# Altium project rf_test_source.PrjPcb (part 2 of 2)
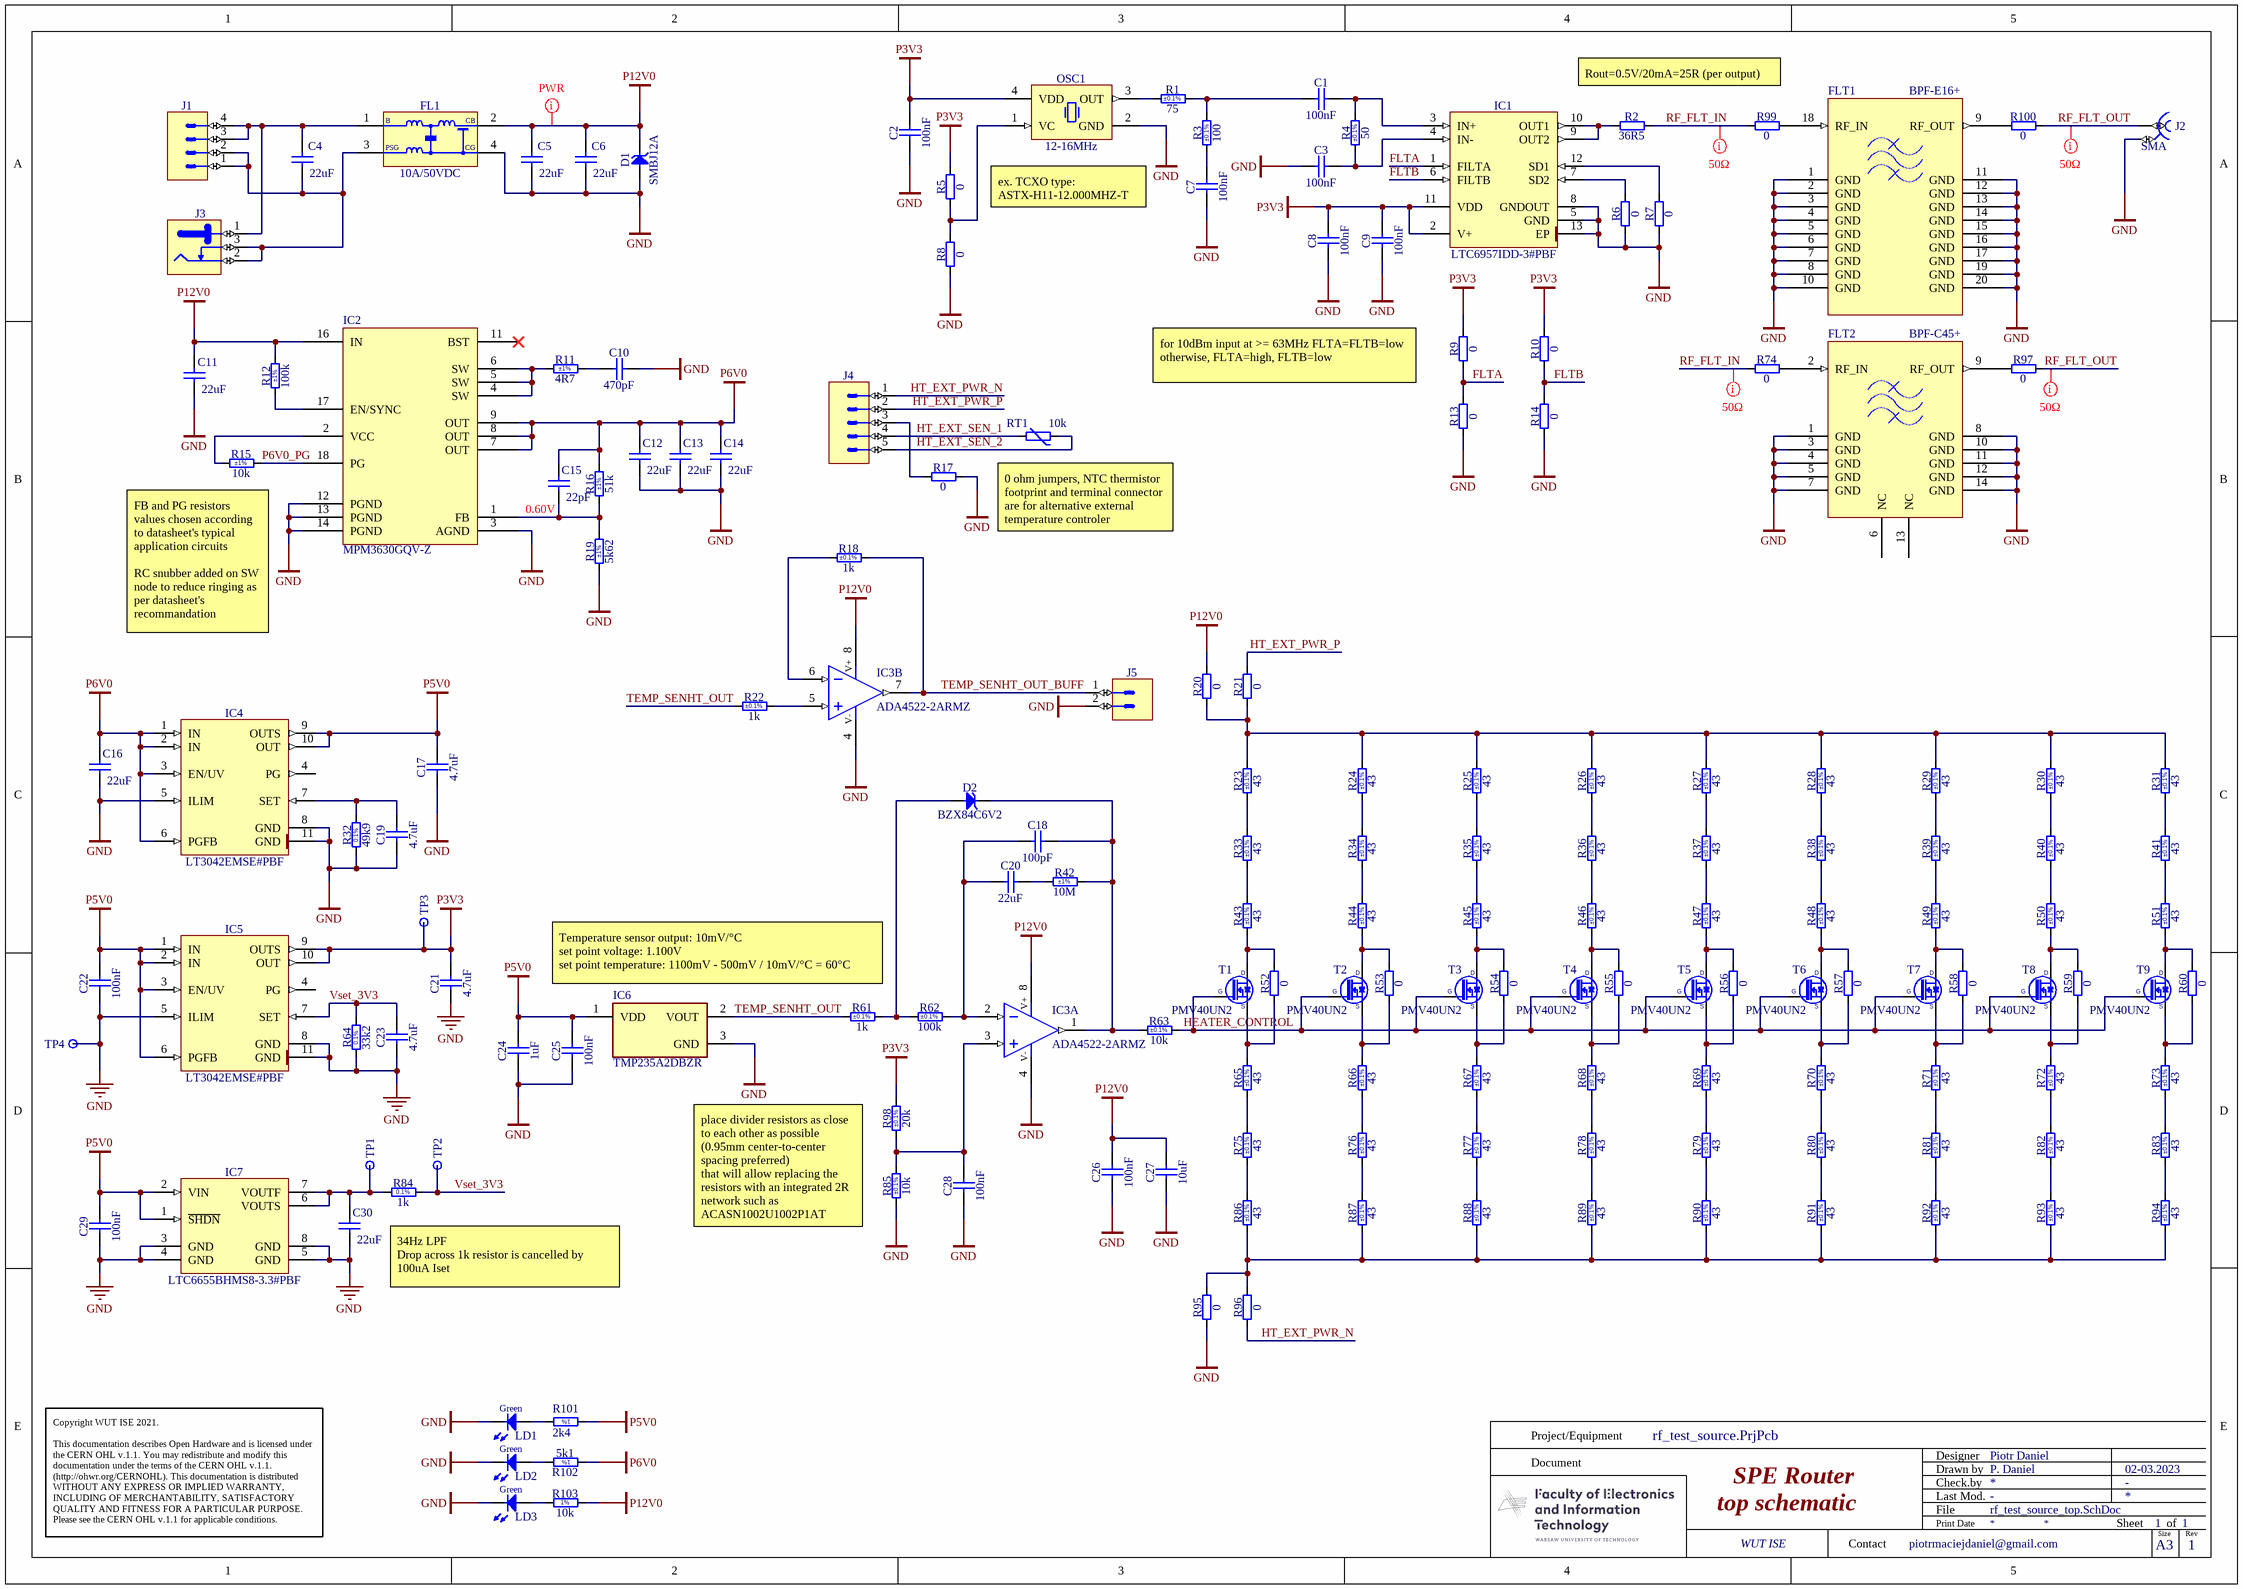
[diagram p1: rf_test_source_top.SchDoc]

## Sheet rf_test_source_top.SchDoc: SPE Router (continued)

### Library data of the parts
C1-C3 C7-C9 C22 C29 = CC0603_100NF_50V_10%_X7R: Non-polarised capacitor; Part Description: SMD Multilayer Chip Ceramic Capacitor; Manufacturer: GENERIC; Manufacturer1 Part Number: 223858615649; Voltage: 50V; TC: X7R; Tolerance: ±10%; Part Number: CC0603_100NF_50V_10%_X7R; Component Kind: Standard; Component Type: Standard; Pin Count: 2; Value: 100nF; Status: Preferred; Manufacturer Part Number: CC0603_100NF_50V_10%_X7R; Case: 0603; Mounted: Yes; Socket: No; SMD: Yes; Sense: No; Manufacturer1 Example: PHYCOMP; Manufacturer1 ComponentHeight: 0.87mm; HelpURL: \\cern.ch\dfs\Applications\Altium\Datasheets\CC0603_X7R_PHYCOMP.pdf; Author: CERN DEM JLC; CreateDate: 03/12/2007; LatestRevisionDate: 03/12/2007
C4-C6 C11-C14 C16 C30 = CC1210_22UF_25V_10%_X7R: Non-polarised capacitor; Part Description: SMD Multilayer Chip Ceramic Capacitor; Manufacturer: GENERIC; Manufacturer1 Part Number: C1210C226K3RAC; Voltage: 25V; TC: X7R; Tolerance: ±10%; Part Number: CC1210_22UF_25V_10%_X7R; Component Kind: Standard; Component Type: Standard; Pin Count: 2; Value: 22uF; Status: None; Manufacturer Part Number: CC1210_22UF_25V_10%_X7R; Case: 1210; Mounted: Yes; Socket: No; SMD: Yes; Sense: No; Manufacturer1 Example: KEMET; Manufacturer1 ComponentHeight: 1.4mm; HelpURL: \\cern.ch\dfs\Applications\Altium\Datasheets\CC1210_X7R_KEMET.pdf; Author: CERN DEM BC; CreateDate: 20.08.2020; LatestRevisionDate: 20.08.2020
C10 = CC0402_470PF_50V_10%_X7R: Non-polarised capacitor; Part Description: SMD Multilayer Chip Ceramic Capacitor; Manufacturer: GENERIC; Manufacturer1 Part Number: 223858715618; Voltage: 50V; TC: X7R; Tolerance: ±10%; Part Number: CC0402_470PF_50V_10%_X7R; Component Kind: Standard; Component Type: Standard; Pin Count: 2; Value: 470pF; Status: Not Recommended; Manufacturer Part Number: CC0402_470PF_50V_10%_X7R; Case: 0402; Mounted: Yes; Socket: No; SMD: Yes; Sense: No; Manufacturer1 Example: PHYCOMP; Manufacturer1 ComponentHeight: 0.55mm; HelpURL: \\cern.ch\dfs\Applications\Altium\Datasheets\CC0402_NP0_PHYCOMP.pdf; Author: CERN DEM JLC; CreateDate: 03.12.2007; LatestRevisionDate: 03.12.2007
C15 = CC0402_22PF_50V_5%_C0G: Non-polarised capacitor; Part Description: SMD Multilayer Chip Ceramic Capacitor; Manufacturer: GENERIC; Manufacturer1 Part Number: C0402C220J5GACTU; Voltage: 50V; TC: C0G/NP0; Tolerance: ±5%; Part Number: CC0402_22PF_50V_5%_C0G; Component Kind: Standard; Component Type: Standard; Pin Count: 2; Value: 22pF; Status: Preferred; Manufacturer Part Number: CC0402_22PF_50V_5%_C0G; Case: 0402; Mounted: Yes; Socket: No; SMD: Yes; Sense: No; Manufacturer1 Example: KEMET; Manufacturer1 ComponentHeight: 0.55mm; HelpURL: \\cern.ch\dfs\Applications\Altium\Datasheets\CC0402_C0G_KEMET_(Commercial Grade).pdf; Author: CERN DEM JLC; CreateDate: 03.12.2007; LatestRevisionDate: 03.12.2007
C17 C19 C21 C23 = CC1206_4.7UF_16V_10%_X5R: Non-polarised capacitor; Part Description: SMD Multilayer Chip Ceramic Capacitor; Manufacturer: GENERIC; Manufacturer1 Part Number: C1206C475K4PAC; Voltage: 16V; TC: X5R; Tolerance: ±10%; Part Number: CC1206_4.7UF_16V_10%_X5R; Component Kind: Standard; Component Type: Standard; Pin Count: 2; Value: 4.7uF; Status: Preferred; Manufacturer Part Number: CC1206_4.7UF_16V_10%_X5R; Case: 1206; Mounted: Yes; Socket: No; SMD: Yes; Sense: No; Manufacturer1 Example: KEMET; Manufacturer1 ComponentHeight: 1.8mm; HelpURL: \\cern.ch\dfs\Applications\Altium\Datasheets\CC1206_X5R_KEMET.pdf; Author: CERN DEM JLC; CreateDate: 03/12/2007; LatestRevisionDate: 03/12/2007
C18 = CC0603_100PF_50V_5%_NP0: Non-polarised capacitor; Part Description: SMD Multilayer Chip Ceramic Capacitor; Manufacturer: GENERIC; Manufacturer1 Part Number: 223886715101; Voltage: 50V; TC: C0G/NP0; Tolerance: ±5%; Part Number: CC0603_100PF_50V_5%_NP0; Component Kind: Standard; Component Type: Standard; Pin Count: 2; Value: 100pF; Status: Preferred; Manufacturer Part Number: CC0603_100PF_50V_5%_NP0; Case: 0603; Mounted: Yes; Socket: No; SMD: Yes; Sense: No; Manufacturer1 Example: PHYCOMP; Manufacturer1 ComponentHeight: 0.87mm; HelpURL: \\cern.ch\dfs\Applications\Altium\Datasheets\CC0603_NP0_PHYCOMP.pdf; Author: CERN DEM JLC; CreateDate: 03.12.2007; LatestRevisionDate: 03.12.2007
C20 = CC0805_22UF_16V_10%_X5R: Non-polarised capacitor; Part Description: SMD Multilayer Chip Ceramic Capacitor; Manufacturer: GENERIC; Manufacturer1 Part Number: C2012X5R1C226KT; Voltage: 16V; TC: X5R; Tolerance: ±10%; Part Number: CC0805_22UF_16V_10%_X5R; Component Kind: Standard; Component Type: Standard; Pin Count: 2; Value: 22uF; Status: Preferred; Manufacturer Part Number: CC0805_22UF_16V_10%_X5R; Case: 0805; Mounted: Yes; Socket: No; SMD: Yes; Sense: No; Manufacturer1 Example: TDK; Manufacturer1 ComponentHeight: 1.35mm; HelpURL: \\cern.ch\dfs\Applications\Altium\Datasheets\CC0805_X5R_TDK_C.pdf; Author: CERN DEM JLC; CreateDate: 25.10.2012; LatestRevisionDate: 25.10.2012
C24 = CC0603_1UF_25V_10%_X7R: Non-polarised capacitor; Part Description: SMD Multilayer Chip Ceramic Capacitor; Manufacturer: GENERIC; Manufacturer1 Part Number: GRM188R71E105KA12D; Voltage: 25V; TC: X7R; Tolerance: ±10%; Part Number: CC0603_1UF_25V_10%_X7R; Component Kind: Standard; Component Type: Standard; Pin Count: 2; Value: 1uF; Status: None; Manufacturer Part Number: CC0603_1UF_25V_10%_X7R; Case: 0603; Mounted: Yes; Socket: No; SMD: Yes; Sense: No; Manufacturer1 Example: MURATA; Manufacturer1 ComponentHeight: 0.9mm; HelpURL: \\cern.ch\dfs\Applications\Altium\Datasheets\CC0603_X7R_MURATA.pdf; Author: CERN DEM JLC; CreateDate: 18.01.2011; LatestRevisionDate: 18.01.2011
C25 C26 C28 = CC0402_100NF_16V_10%_X7R: Non-polarised capacitor; Part Description: SMD Multilayer Chip Ceramic Capacitor; Manufacturer: GENERIC; Manufacturer1 Part Number: GRM155R71C104KA88D; Voltage: 16V; TC: X7R; Tolerance: ±10%; Part Number: CC0402_100NF_16V_10%_X7R; Component Kind: Standard; Component Type: Standard; Pin Count: 2; Value: 100nF; Status: Not Recommended; Manufacturer Part Number: CC0402_100NF_16V_10%_X7R; Case: 0402; Mounted: Yes; Socket: No; SMD: Yes; Sense: No; Manufacturer1 Example: MURATA; Manufacturer1 ComponentHeight: 0.55mm; HelpURL: \\cern.ch\dfs\Applications\Altium\Datasheets\CC0402_X7R_MURATA_GRM.pdf; Author: CERN DEM JLC; CreateDate: 05.12.2013; LatestRevisionDate: 03.12.2007
C27 = CC0805_10UF_10V_10%_X7R: Non-polarised capacitor; Part Description: SMD Multilayer Chip Ceramic Capacitor; Manufacturer: GENERIC; Manufacturer1 Part Number: GRM21BR71A106KE51L; Voltage: 10V; TC: X7R; Tolerance: ±10%; Part Number: CC0805_10UF_10V_10%_X7R; Component Kind: Standard; Component Type: Standard; Pin Count: 2; Value: 10uF; Status: Preferred; Manufacturer Part Number: CC0805_10UF_10V_10%_X7R; Case: 0805; Mounted: Yes; Socket: No; SMD: Yes; Sense: No; Manufacturer1 Example: MURATA; Manufacturer1 ComponentHeight: 1.35mm; HelpURL: \\cern.ch\dfs\Applications\Altium\Datasheets\CC0805_X7R_MURATA.pdf; Author: CERN DEM JLC; CreateDate: 30.04.2012; LatestRevisionDate: 30.04.2012
D1 = SMBJ12A: Zener Diode; Part Description: Uni-Directional Transient Voltage Suppressor Diode; Manufacturer: FAIRCHILD SEMICONDUCTOR; Voltage: 12V; Power: 600W; PressFit: No; Bonding: No; Part Number: SMBJ12A; Component Kind: Standard; Component Type: Standard; Device: SMBJ12A; PackageDescription: DO-214-AA/SMB Diode, Molded Body; 5.34mm L X 3.625mm W X 2.65mm H, IPC Medium Density; Manufacturer Part Number: SMBJ12A; Pin Count: 2; Case: DO-214AA; Mounted: Yes; Socket: No; SMD: Yes; Sense: No; ComponentHeight: 2.65mm; HelpURL: \\cern.ch\dfs\Applications\Altium\Datasheets\SMBJ.pdf; Author: CERN DEM JLC; CreateDate: 10.04.2013; LatestRevisionDate: 10.04.2013
D2 = BZX84C6V2: Diode Zener Anode Pin 1 Cathode Pin 3 (Pas de pin 2); Part Description: Small Signal Zener Diode; Manufacturer: VISHAY SEMICONDUCTORS; Voltage: 6V2; Power: 300mW; PressFit: No; Bonding: No; Part Number: BZX84C6V2; Component Kind: Standard; Component Type: Standard; Device: BZX84C6V2; PackageDescription: SOT, 0.95mm Pitch; 3 Pin, 1.315mm W X 2.95mm L X 1.15mm H body, IPC Medium Density; Manufacturer Part Number: BZX84C6V2; Pin Count: 3; Case: SOT23-3; Mounted: Yes; Socket: No; SMD: Yes; Sense: No; ComponentHeight: 1.15mm; HelpURL: \\cern.ch\dfs\Applications\Altium\Datasheets\BZX84C6V2.pdf; Author: CERN DEM BC; CreateDate: 10.10.2019; LatestRevisionDate: 10.10.2019
FL1 = FIL_MURATA_BNX022-01L: Block Type EMIFIL (LC Combined); Part Description: Block Type EMIFIL (LC Combined) SMD Type, BNX02* Series; Manufacturer: MURATA; Resistance: 0.5R; Part Number: FIL_MURATA_BNX022-01L; Component Kind: Standard; Component Type: Standard; Pin Count: 2; Value: 10A/50VDC; Status: None; Manufacturer Part Number: BNX022-01L; Mounted: Yes; Socket: No; SMD: Yes; Sense: No; ComponentHeight: 3.3mm; HelpURL: \\cern.ch\dfs\Applications\Altium\Datasheets\FIL_MURATA_BNX022-01L.pdf; Author: CERN DEM JLC; CreateDate: 10.10.2012; LatestRevisionDate: 10.10.2012
FLT1 = BPF-E16+: Band Pass Filter, 16MHz; Manufacturer: Mini-Circuits; Average Input Power: 500mW; Input Impedance: 50R; Insertion Loss-Max: 3dB; VSWR: 1.9; Supplier 1: Digikey; Manufacturer Part Number: BPF-E16+; RoHS: Yes; Stock 1: 41; Pricing 1: 1=36,35, 10=33,312, 50=31,8 (USD); Mounting Technology: Surface Mount; Terminal Finish: Gold; Min Operating Temperature: -40°C; Max Operating Temperature: 85°C; JESD-609 Code: e4; Center or Cutoff Frequency (fo/fc): 16MHz; Filter Type: BAND PASS FILTER; Output Impedance: 50R; Length: 30.48mm; Width: 30.48mm; Height: 9.4mm; RoHS Compliant: Yes; Reach SVHC Compliant: Yes; ComponentLink1URL: https://datasheet.ciiva.com:443/pdfs/VipMasterIC/IC/MINI/MINI-S-A0002947472/MINI-S-A0002947472-1.pdf?src-supplier=IHS+Markit; ComponentLink1Description: https://datasheet.ciiva.com:443/pdfs/VipMasterIC/IC/MINI/MINI-S-A0002947472/MINI-S-A0002947472-1.pdf?src-supplier=IHS+Markit; Supplier Part Number 1: 3157-BPF-E16+CT-ND
FLT2 = BPF-C45+: Band Pass Filter, 45MHz, 14 Pin(s); Manufacturer: Mini-Circuits; Supplier 1: Digikey; Manufacturer Part Number: BPF-C45+; RoHS: Yes; Stock 1: 219; Pricing 1: 1=48,49, 10=45,456, 25=42,4204, 50=40,908, 100=39,3841 (USD); Supplier Part Number 1: 3157-BPF-C45+CT-ND
IC1 = LTC6957IDD-3#PBF: Low Phase Noise, Dual Output Buffer/Driver/Logic Converter, CMOS Logic, In-Phase Outputs; Manufacturer: LINEAR TECHNOLOGY; PressFit: No; Bonding: No; Part Number: LTC6957IDD-3#PBF; Component Kind: Standard; Component Type: Standard; Device: LTC6957IDD-3#PBF; PackageDescription: SON, 0.45mm Pitch; 12 Pin, 3.00mm W X 3.00mm L X 0.80mm H Body (w/Thermal tab 1.75 x 2.48mm), IPC Medium Density; Part Description: Low Phase Noise, Dual Output Buffer/Driver/Logic Converter, CMOS Logic, In-Phase Outputs; Manufacturer Part Number: LTC6957IDD-3#PBF; Pin Count: 13; Case: SON12; Mounted: Yes; Socket: No; SMD: Yes; Sense: No; ComponentHeight: 0.8mm; Author: CERN DEM JMW; HelpURL: \\cern.ch\dfs\Applications\Altium\Datasheets\LTC6957IDD-3#PBF.pdf; CreateDate: 08/08/2016; LatestRevisionDate: 07/12/2016
IC2 = MPM3630GQV-Z: 18V/3A DC/DC Module Synchronous Step-Down Regulator with Integrated Inductor; Manufacturer: Monolithic Power Systems; Supplier 1: Farnell; Manufacturer Part Number: MPM3630GQV-Z; RoHS: Yes; Category: Board Mount Modules; Stock 1: 4233; Case/Package: QFN; Pins: 18; Series: *; RoHS Compliant: Yes; ComponentLink1URL: http://www.monolithicpower.com/pub/media/document/MPM3630_r1.0.pdf?src-supplier=Digikey; ComponentLink1Description: http://www.monolithicpower.com/pub/media/document/MPM3630_r1.0.pdf?src-supplier=Digikey; ComponentLink2URL: https://www.monolithicpower.com/pub/media/document/MPM3630_r1.0.pdf?src-supplier=Digikey; ComponentLink2Description: https://www.monolithicpower.com/pub/media/document/MPM3630_r1.0.pdf?src-supplier=Digikey; ComponentLink3URL: https://datasheet.octopart.com/MPM3630GQV-Z-Monolithic-Power-Systems-datasheet-140259359.pdf?src-supplier=Newark; ComponentLink3Description: https://datasheet.octopart.com/MPM3630GQV-Z-Monolithic-Power-Systems-datasheet-140259359.pdf?src-supplier=Newark; ComponentLink4URL: https://datasheet.octopart.com/MPM3630GQV-Z-Monolithic-Power-Systems-datasheet-81324618.pdf?src-supplier=Future+Electronics; ComponentLink4Description: https://datasheet.octopart.com/MPM3630GQV-Z-Monolithic-Power-Systems-datasheet-81324618.pdf?src-supplier=Future+Electronics; ComponentLink5URL: https://www.monolithicpower.com/DesktopModules/DocumentManage/API/Document/GetDocument?id=4863&src-supplier=Digikey; ComponentLink5Description: https://www.monolithicpower.com/DesktopModules/DocumentManage/API/Document/GetDocument?id=4863&src-supplier=Digikey; ComponentLink6URL: https://datasheet.octopart.com/MPM3630GQV-Z-Monolithic-Power-Systems-datasheet-155982336.pdf?src-supplier=Monolithic+Power+Systems; ComponentLink6Description: https://datasheet.octopart.com/MPM3630GQV-Z-Monolithic-Power-Systems-datasheet-155982336.pdf?src-supplier=Monolithic+Power+Systems; Supplier Part Number 1: 3358182
IC3 = ADA4522-2ARMZ: Dual Operational Amplifier; Part Description: 55V, EMI Enhanced, Zero Drift, Ultralow Noise, Dual Rail-to-Rail Output Operational Amplifier; Manufacturer: ANALOG DEVICES; PressFit: No; Bonding: No; Part Number: ADA4522-2ARMZ; Component Kind: Standard; Component Type: Standard; Device: ADA4522-2ARMZ; PackageDescription: SOP, 0.65mm Pitch; 8 Pin, 3.00mm W X 3.00mm L X 1.10mm H body, IPC Medium Density; Manufacturer Part Number: ADA4522-2ARM; Pin Count: 8; Case: MSOP8; Mounted: Yes; Socket: No; SMD: Yes; Sense: No; ComponentHeight: 1.1mm; Author: CERN DEM BC; HelpURL: \\cern.ch\dfs\Applications\Altium\Datasheets\ADA4522-2ARMZ.pdf; CreateDate: 28.07.2017; LatestRevisionDate: 31.03.2022
IC4 IC5 = LT3042EMSE#PBF: 20V, 200mA, Ultralow Noise, Ultrahigh PSRR RF Linear Regulator; Manufacturer: LINEAR TECHNOLOGY; PressFit: No; Bonding: No; Part Number: LT3042EMSE#PBF; Component Kind: Standard; Component Type: Standard; Device: LT3042EMSE#PBF; PackageDescription: SOP, 0.50mm, Pitch; 10 pin, 3.00mm W X 3.00mm L X 1.10mm H body (w/thermal tab  1.68 X 1.98 mm), IPC Medium Density; Part Description: 20V, 200mA, Ultralow Noise, Ultrahigh PSRR RF Linear Regulator; Manufacturer Part Number: LT3042EMSE#PBF; Pin Count: 11; Case: MSOP10; Mounted: Yes; Socket: No; SMD: Yes; Sense: No; ComponentHeight: 1.1mm; HelpURL: \\cern.ch\dfs\Applications\Altium\Datasheets\LT3042EMSE#PBF.pdf; Author: CERN DEM MR; CreateDate: 09/06/2016; LatestRevisionDate: 09/06/2016
IC6 = CMP-04948-000003-1: LOW-POWER HIGH-ACCURACY ANALOG O; Manufacturer: Texas Instruments; Output Current: 500uA; Operating Supply Current: 9uA; Max Supply Voltage: 5.5V; Max Junction Temp: +150°C; Accuracy: 0.5%; Min Supply Voltage: 2.3V; Standoff Height: 0.01mm; Sensor Output: Analog Voltage; Ambient Temperature Range Low: -40°C; Device Class L2: Temperature and Humidity Sensors; Digikey Description: LOW-POWER HIGH-ACCURACY ANALOG O; Lead Free: Yes; Category: IC; Device Class L3: unset; Temperature Range Low: -40°C; Manufacturer Part Number: TMP235A2DBZR; ComponentLink2Description: Datasheet; Package: DBZ0003A; Octopart: https://octopart.com/tmp235a2dbzr-texas+instruments-94966376; Device Class L1: Sensors; Temperature Range High: +150°C; Height: 1.12mm; Temperature: -40°C to +150°C; RoHS: TRUE; Ambient Temperature Range High: +150°C; Automotive: No; ComponentLink2URL: http://www.ti.com/lit/ds/symlink/tmp235.pdf; Mouser Description: ±2°C Analog output temperature sensor, with 10mV /°C gain 3-SOT-23 -40 to 150; Part Number: TMP235A2DBZR
IC7 = LTC6655BHMS8-3.3#PBF: 0.25ppm Noise, Low Drift Precision Buffered Voltage Reference; Part Description: 3V3, 0.25ppm Noise, Low Drift Precision Buffered Voltage Reference; Manufacturer: LINEAR TECHNOLOGY; PressFit: No; Bonding: No; Part Number: LTC6655BHMS8-3.3#PBF; Component Kind: Standard; Component Type: Standard; Device: LTC6655BHMS8-3.3#PBF; PackageDescription: SOP, 8-Leads, Body 3.1x3.1mm (max), Pitch 0.65mm, IPC Medium Density; Manufacturer Part Number: LTC6655BHMS8-3.3#PBF; Pin Count: 8; Case: SSOP8; Mounted: Yes; Socket: No; SMD: Yes; Sense: No; ComponentHeight: 1.1mm; HelpURL: \\cern.ch\dfs\Applications\Altium\Datasheets\LTC6655BHMS8-3.3#PBF.pdf; Author: CERN DEM BC; CreateDate: 03/03/2016; LatestRevisionDate: 22/11/2016
J1 = MOLEX_39-30-0040: Connector 4 Male; Part Description: 4.20mm (.165") Pitch Mini-Fit Jr. Header, Dual Row, Right Angle with Snap-in Plastic Peg PCB Lock, 4 Circuits; Manufacturer: MOLEX; PressFit: No; Part Number: MOLEX_39-30-0040; Component Kind: Standard; Component Type: Standard; Pin Count: 4; Family: Mini-Fit Jr.™; Mounted: Yes; Socket: No; SMD: No; Sense: No; Status: None; Manufacturer Part Number: 39-30-0040; ComponentHeight: 11.4mm; HelpURL: \\cern.ch\dfs\Applications\Altium\Datasheets\MOLEX_39-30-0040.pdf; Author: CERN DEM JLC; CreateDate: 2018-10-02; LatestRevisionDate: 2018-10-02
J2 = MOLEX_73251-2121: Part Description: 50 Ohm, SMA Edge Mount PCB, With Jam Nut And Lock Washer; Manufacturer: MOLEX; PressFit: No; Part Number: MOLEX_73251-2121; Component Kind: Standard; Component Type: Standard; Pin Count: 5; Family: SMA; Mounted: Yes; Socket: No; SMD: No; Sense: No; Status: None; Manufacturer Part Number: 73251-2121; ComponentHeight: 5.75mm; HelpURL: \\cern.ch\dfs\Applications\Altium\Datasheets\MOLEX_73251-2121.pdf; Author: CERN DEM JLC; CreateDate: 26.10.2016; LatestRevisionDate: 27.03.2017
J3 = SWITCHCRAFT_712RA: 2.5 mm Center Pin, 5A, 48V, Right Angle, Through Hole, , DC Power Jack Connector; Part Description: 2.5 mm Center Pin, 5A, 48VDC, Right Angle, Through Hole, Locking Power Jack Connector (Threaded Bushings); Manufacturer Part Number: 712RA; PressFit: No; Part Number: SWITCHCRAFT_712RA; Component Kind: Standard; Component Type: Standard; Pin Count: 3; Family: Jack; Mounted: Yes; Socket: No; SMD: No; Sense: No; Status: None; Manufacturer: SWITCHCRAFT; ComponentHeight: 13.8mm; HelpURL: \\cern.ch\dfs\Applications\Altium\Datasheets\SWITCHCRAFT_712RA.pdf; Author: CERN DEM JLC; CreateDate: 2017-12-19; LatestRevisionDate: 2017-12-19
J4 = PHOENIX_1803303: Connector 5 Male; Part Description: 8A 160 V, Pitch: 3.81mm, 5 Positions  Right Angled Header; Manufacturer: PHOENIX CONTACT; Manufacturer Part Number: 1803303 (MC 1,5/ 5-G-3,81); PressFit: No; Part Number: PHOENIX_1803303; Component Kind: Standard; Component Type: Standard; Pin Count: 5; Mounted: Yes; Socket: No; SMD: No; Sense: No; Status: None; ComponentHeight: 7.25mm; HelpURL: \\cern.ch\dfs\Applications\Altium\Datasheets\PHOENIX_1803303.pdf; Author: CERN DEM JLC; CreateDate: 11.06.2013; LatestRevisionDate: 11.06.2013
J5 = MOLEX_22-05-7028: Connector 2 Male; Part Description: 2.54mm (.100") Pitch KK® Wire-To-Board Header, Right Angle, with Friction Lock, 2 Circuits; Manufacturer: MOLEX; PressFit: No; Part Number: MOLEX_22-05-7028; Component Kind: Standard; Component Type: Standard; Pin Count: 2; Family: KK®; Mounted: Yes; Socket: No; SMD: No; Sense: No; Status: None; Manufacturer Part Number: 22-05-7028; ComponentHeight: 5.8mm; HelpURL: \\cern.ch\dfs\Applications\Altium\Datasheets\MOLEX_22-05-7028.pdf; Author: CERN DEM JLC; CreateDate: 24.01.2011; LatestRevisionDate: 24.01.2011
LD1-LD3 = LED_KINGBRIGHT_KPH-1608CGCK: LED Green 1C 2A; Part Description: SMD Green LED, Case 1.6mmX0.8mm(0603), 0.65mm Thickness; PressFit: No; Bonding: No; Part Number: LED_KINGBRIGHT_KPH-1608CGCK; Component Kind: Standard; Component Type: Standard; Color: Green; PackageDescription: SMT Green LED, Case 0603, Body L 1.6 x W 0.8mm H 0.65mm; Manufacturer: KINGBRIGHT; Manufacturer Part Number: KPH-1608CGCK; Pin Count: 2; Mounted: Yes; Socket: No; SMD: Yes; Sense: No; ComponentHeight: 0.65mm; HelpURL: \\cern.ch\dfs\Applications\Altium\Datasheets\LED_KINGBRIGHT_KPH-1608CGCK.pdf; Author: CERN DEM JLC; CreateDate: 03/07/2017; LatestRevisionDate: 03/07/2017
OSC1 = OSC_25MHZ_TAITIEN_TXEAADSANF-25.000000: Oscillator 4 pins 1=VC 2=GND 3=OUT 4=VDD; Part Description: TCXO; PressFit: No; Bonding: No; Part Number: 12-16MHz; Component Kind: Standard; Component Type: Standard; PackageDescription: Oscillator, Corner Concave, 4 Pin, 3.2mm L X 2.5mm W X 1mm H; Value: 12-16Mhz; Pin Count: 4; Mounted: Yes; Socket: No; SMD: Yes; Sense: No; ComponentHeight: 1mm; HelpURL: \\cern.ch\dfs\Applications\Altium\Datasheets\OSC_TAITIEN_TX_TYPE.pdf; Author: CERN DEM HF; CreateDate: 15.03.2022; LatestRevisionDate: 15.03.2022
R1 = R0603_75R_0.1%_0.063W_25PPM: Resistor - 0.1%; Part Description: Thin Film Chip Resistor; Manufacturer: GENERIC; Manufacturer1 Part Number: CPF0603B75RE1; Power: 0.063W; TC: ±25ppm/°C; PressFit: No; Part Number: R0603_75R_0.1%_0.063W_25PPM; Component Kind: Standard; Component Type: Standard; Pin Count: 2; Value: 75; Status: Not Recommended; Manufacturer Part Number: R0603_75R_0.1%_0.063W_25PPM; Case: 0603; Mounted: Yes; Sense: No; Socket: No; SMD: Yes; Manufacturer1 Example: TE CONNECTIVITY; Manufacturer1 ComponentHeight: 0.55mm; HelpURL: \\cern.ch\dfs\Applications\Altium\Datasheets\R0603_TYCO_CPF.pdf; Author: CERN DEM JLC; CreateDate: 11.01.2017; LatestRevisionDate: 11.01.2017
R2 = R0402_36R_1%_0.0625W_100PPM: Resistor - 0.1%; Part Number: R0402_36R5_0.1%_0.0625W_50PPM; Part Description: General Purpose Thick Film Chip Resistor; Manufacturer: GENERIC; Manufacturer Part Number: R0402_36R_0.1%_0.0625W_50PPM; Manufacturer1 Part Number: 232270673609L; TC: ±100ppm/°C; PressFit: No; Component Kind: Standard; Component Type: Standard; Pin Count: 2; Value: 36R5; Status: Not Recommended; Power: 0.0625W; Tolerance: ±0.1%; Case: 0402; Mounted: Yes; Sense: No; Socket: No; SMD: Yes; Manufacturer1 Example: YAGEO PHYCOMP; Manufacturer1 ComponentHeight: 0.4mm; HelpURL: \\cern.ch\dfs\Applications\Altium\Datasheets\R0402_Phycomp_RC0402.pdf; Author: CERN DEM JLC; CreateDate: 03.12.2007; LatestRevisionDate: 17.10.2012
R3 = R0603_100R_0.1%_0.1W_25PPM: Resistor - 0.1%; Part Description: Thin Film Chip Resistor; Manufacturer: GENERIC; Manufacturer1 Part Number: ERA3AEB101V; Power: 0.1W; TC: ±25ppm/°C; PressFit: No; Part Number: R0603_100R_0.1%_0.1W_25PPM; Component Kind: Standard; Component Type: Standard; Pin Count: 2; Value: 100; Status: Not Recommended; Manufacturer Part Number: R0603_100R_0.1%_0.1W_25PPM; Case: 0603; Mounted: Yes; Sense: No; Socket: No; SMD: Yes; Manufacturer1 Example: PANASONIC; Manufacturer1 ComponentHeight: 0.55mm; HelpURL: \\cern.ch\dfs\Applications\Altium\Datasheets\R0603_PANASONIC_ERA.pdf; Author: CERN DEM JLC; CreateDate: 11.01.2017; LatestRevisionDate: 11.01.2017
R4 = R0603_50R_0.1%_0.125W_25PPM_VISHAY_FC0603E50R0BTBST1: Resistor - 0.1%; Part Description: High Frequency (up to 40 GHz) Thin Film Surface Mount Chip Resistor; Manufacturer: VISHAY DALE; Power: 0.125W; TC: ±25ppm/°C; PressFit: No; Part Number: R0603_50R_0.1%_0.125W_25PPM_VISHAY_FC0603E50R0BTBST1; Component Kind: Standard; Component Type: Standard; Pin Count: 2; Value: 50; Status: Not Recommended; Manufacturer Part Number: FC0603E50R0BTBST1; Case: 0603; Mounted: Yes; Sense: No; Socket: No; SMD: Yes; ComponentHeight: 0.38mm; HelpURL: \\cern.ch\dfs\Applications\Altium\Datasheets\R0603_VISHAY_FC.pdf; Author: CERN DEM JLC; CreateDate: 16.11.2017; LatestRevisionDate: 28.06.2022
R5 R9 = R0603_0R_JUMPER: Resistor; Part Description: 1A (0.05R Max DC Resistance) Zero Ohm Jumper; Manufacturer: GENERIC; Manufacturer1 Part Number: NRC06Z0; PressFit: No; Mounted: No; Part Number: R0603_0R_JUMPER; Component Kind: Standard; Component Type: Standard; Pin Count: 2; Value: 0; Status: Preferred; Manufacturer Part Number: R0603_0R_JUMPER; Case: 0603; Sense: No; Socket: No; SMD: Yes; Manufacturer1 Example: NIC COMPONENT; Manufacturer1 ComponentHeight: 0.55mm; HelpURL: \\cern.ch\dfs\Applications\Altium\Datasheets\R0603_NIC_NRC.pdf; Author: CERN DEM JLC; CreateDate: 03/12/2007; LatestRevisionDate: 13/03/2008
R6-R8 R10 R13 R14 R52-R60 = R0603_0R_JUMPER: Resistor; Part Description: 1A (0.05R Max DC Resistance) Zero Ohm Jumper; Manufacturer: GENERIC; Manufacturer1 Part Number: NRC06Z0; PressFit: No; Part Number: R0603_0R_JUMPER; Component Kind: Standard; Component Type: Standard; Pin Count: 2; Value: 0; Status: Preferred; Manufacturer Part Number: R0603_0R_JUMPER; Case: 0603; Mounted: Yes; Sense: No; Socket: No; SMD: Yes; Manufacturer1 Example: NIC COMPONENT; Manufacturer1 ComponentHeight: 0.55mm; HelpURL: \\cern.ch\dfs\Applications\Altium\Datasheets\R0603_NIC_NRC.pdf; Author: CERN DEM JLC
  R6-R8 R10 R13 R14: CreateDate: 03/12/2007; LatestRevisionDate: 13/03/2008
  R52-R60: CreateDate: 03.12.2007; LatestRevisionDate: 13.03.2008
R11 = R0402_4R7_1%_0.0625W_200PPM: Resistor - 1%; Part Description: General Purpose Thick Film Chip Resistor; Manufacturer: GENERIC; Manufacturer1 Part Number: 232270674708L; TC: ±200ppm/°C; PressFit: No; Part Number: R0402_4R7_1%_0.0625W_200PPM; Component Kind: Standard; Component Type: Standard; Pin Count: 2; Value: 4R7; Status: Not Recommended; Power: 0.0625W; Manufacturer Part Number: R0402_4R7_1%_0.0625W_200PPM; Case: 0402; Mounted: Yes; Sense: No; Socket: No; SMD: Yes; Manufacturer1 Example: YAGEO PHYCOMP; Manufacturer1 ComponentHeight: 0.4mm; HelpURL: \\cern.ch\dfs\Applications\Altium\Datasheets\R0402_Phycomp_RC0402.pdf; Author: CERN DEM JLC; CreateDate: 03.12.2007; LatestRevisionDate: 17.10.2012
R12 = R0402_100K_1%_0.0625W_100PPM: Resistor - 1%; Part Description: General Purpose Thick Film Chip Resistor; Manufacturer: GENERIC; Manufacturer1 Part Number: 232270671004L; TC: ±100ppm/°C; PressFit: No; Part Number: R0402_100K_1%_0.0625W_100PPM; Component Kind: Standard; Component Type: Standard; Pin Count: 2; Value: 100k; Status: Not Recommended; Power: 0.0625W; Manufacturer Part Number: R0402_100K_1%_0.0625W_100PPM; Case: 0402; Mounted: Yes; Sense: No; Socket: No; SMD: Yes; Manufacturer1 Example: YAGEO PHYCOMP; Manufacturer1 ComponentHeight: 0.4mm; HelpURL: \\cern.ch\dfs\Applications\Altium\Datasheets\R0402_Phycomp_RC0402.pdf; Author: CERN DEM JLC; CreateDate: 03.12.2007; LatestRevisionDate: 17.10.2012
R15 R103 = R0402_10K_1%_0.0625W_100PPM: Resistor - 1%; Part Description: General Purpose Thick Film Chip Resistor; Manufacturer: GENERIC; Manufacturer1 Part Number: 232270671003L; TC: ±100ppm/°C; PressFit: No; Part Number: R0402_10K_1%_0.0625W_100PPM; Component Kind: Standard; Component Type: Standard; Pin Count: 2; Value: 10k; Status: Not Recommended; Power: 0.0625W; Manufacturer Part Number: R0402_10K_1%_0.0625W_100PPM; Case: 0402; Mounted: Yes; Sense: No; Socket: No; SMD: Yes; Manufacturer1 Example: YAGEO PHYCOMP; Manufacturer1 ComponentHeight: 0.4mm; HelpURL: \\cern.ch\dfs\Applications\Altium\Datasheets\R0402_Phycomp_RC0402.pdf; Author: CERN DEM JLC; CreateDate: 03.12.2007; LatestRevisionDate: 17.10.2012
  R103: Tolerance: ±1%
R16 = R0402_51K_1%_0.0625W_100PPM: Resistor - 1%; Part Description: General Purpose Thick Film Chip Resistor; Manufacturer: GENERIC; Manufacturer1 Part Number: 232270675103L; TC: ±100ppm/°C; PressFit: No; Part Number: R0402_51K_1%_0.0625W_100PPM; Component Kind: Standard; Component Type: Standard; Pin Count: 2; Value: 51k; Status: Not Recommended; Power: 0.0625W; Manufacturer Part Number: R0402_51K_1%_0.0625W_100PPM; Case: 0402; Mounted: Yes; Sense: No; Socket: No; SMD: Yes; Manufacturer1 Example: YAGEO PHYCOMP; Manufacturer1 ComponentHeight: 0.4mm; HelpURL: \\cern.ch\dfs\Applications\Altium\Datasheets\R0402_Phycomp_RC0402.pdf; Author: CERN DEM JLC; CreateDate: 03.12.2007; LatestRevisionDate: 17.10.2012
R17 R20 R21 R95 R96 = R0805_0R_JUMPER: Resistor; Part Description: 2A (0.05R Max DC Resistance) Zero Ohm Jumper; Manufacturer: GENERIC; Manufacturer1 Part Number: NRC10Z0; PressFit: No; Part Number: R0805_0R_JUMPER; Component Kind: Standard; Component Type: Standard; Pin Count: 2; Value: 0; Status: Preferred; Manufacturer Part Number: R0805_0R_JUMPER; Case: 0805; Mounted: Yes; Sense: No; Socket: No; SMD: Yes; Manufacturer1 Example: NIC COMPONENT; Manufacturer1 ComponentHeight: 0.6mm; HelpURL: \\cern.ch\dfs\Applications\Altium\Datasheets\R0805_NIC_NRC.pdf; Author: CERN DEM JLC; CreateDate: 03.12.2007; LatestRevisionDate: 13.03.2008
R18 R22 R61 R84 = R0603_1K_0.1%_0.063W_10PPM: Resistor - 0.1%; Part Description: Thin Film Chip Resistor; Manufacturer: GENERIC; Manufacturer1 Part Number: RN73C1J1K0BTG; Power: 0.063W; TC: ±10ppm; PressFit: No; Part Number: R0603_1K_0.1%_0.063W_10PPM; Component Kind: Standard; Component Type: Standard; Pin Count: 2; Value: 1k; Status: Not Recommended; Manufacturer Part Number: R0603_1K_0.1%_0.063W_10PPM; Case: 0603; Mounted: Yes; Sense: No; Socket: No; SMD: Yes; Manufacturer1 Example: TYCO HOLSWORTHY; Manufacturer1 ComponentHeight: 0.55mm; HelpURL: \\cern.ch\dfs\Applications\Altium\Datasheets\R0603_Tyco_RN73.pdf; Author: CERN DEM BC
  R18 R22 R61: CreateDate: 23.05.2016; LatestRevisionDate: 23.05.2016
  R84: Tolerance: ±0.1%; CreateDate: 23/05/2016; LatestRevisionDate: 23/05/2016
R19 = R0402_5K6_1%_0.0625W_100PPM: Resistor - 1%; Part Number: R0402_5K62_1%_0.0625W_100PPM; Part Description: General Purpose Thick Film Chip Resistor; Manufacturer: GENERIC; TC: ±100ppm/°C; PressFit: No; Component Kind: Standard; Component Type: Standard; Pin Count: 2; Value: 5k62; Status: Not Recommended; Power: 0.0625W; Manufacturer Part Number: R0402_5K62_1%_0.0625W_100PPM; Case: 0402; Mounted: Yes; Sense: No; Socket: No; SMD: Yes; Manufacturer1 ComponentHeight: 0.4mm; HelpURL: \\cern.ch\dfs\Applications\Altium\Datasheets\R0402_Phycomp_RC0402.pdf; Author: CERN DEM JLC; CreateDate: 03.12.2007; LatestRevisionDate: 17.10.2012; Manufacturer1 Example: YAGEO PHYCOMP
R23-R31 R33-R41 R43-R51 R65-R73 R75-R83 R86-R94 = R1206_43R_0.1%_0.25W_25PPM: Resistor - 0.1%; Part Description: Thin Film Chip Resistor; Manufacturer: GENERIC; Manufacturer1 Part Number: RN73H2BTTD43R0B25; Power: 0.25W; TC: ±25ppm/°C; PressFit: No; Part Number: R1206_43R_0.1%_0.25W_25PPM; Component Kind: Standard; Component Type: Standard; Pin Count: 2; Value: 43; Status: Not Recommended; Manufacturer Part Number: R1206_43R_0.1%_0.25W_25PPM; Case: 1206; Mounted: Yes; Sense: No; Socket: No; SMD: Yes; Manufacturer1 Example: KOA; Manufacturer1 ComponentHeight: 0.70mm; HelpURL: \\cern.ch\dfs\Applications\Altium\Datasheets\R1206_KOA_RN73H.pdf; Author: CERN DEM JLC; CreateDate: 03.12.2007; LatestRevisionDate: 13.03.2008
R32 = R0603_49K9_0.1%_0.063W_10PPM: Resistor - 0.1%; Part Description: Thin Film Chip Resistor; Manufacturer: GENERIC; Manufacturer1 Part Number: RN73C1J49K9BTDF; Power: 0.063W; TC: ±10ppm; PressFit: No; Part Number: R0603_49K9_0.1%_0.063W_10PPM; Component Kind: Standard; Component Type: Standard; Pin Count: 2; Value: 49k9; Status: Not Recommended; Tolerance: ±0.1%; Manufacturer Part Number: R0603_49K9_0.1%_0.063W_10PPM; Case: 0603; Mounted: Yes; Sense: No; Socket: No; SMD: Yes; Manufacturer1 Example: TYCO HOLSWORTHY; Manufacturer1 ComponentHeight: 0.5mm; HelpURL: \\cern.ch\dfs\Applications\Altium\Datasheets\R0603_Tyco_RN73.pdf; Author: CERN DEM JLC; CreateDate: 03/12/2007; LatestRevisionDate: 13/03/2008
R42 = R0603_10M_1%_0.1W_100PPM: Resistor - 1%; Part Description: General Purpose Thick Film Chip Resistor; Manufacturer: GENERIC; Manufacturer1 Part Number: CRCW060310M0FKEA; Power: 0.1W; TC: ±100ppm/°C; PressFit: No; Part Number: R0603_10M_1%_0.1W_100PPM; Component Kind: Standard; Component Type: Standard; Pin Count: 2; Value: 10M; Status: Preferred; Manufacturer Part Number: R0603_10M_1%_0.1W_100PPM; Case: 0603; Mounted: Yes; Sense: No; Socket: No; SMD: Yes; Manufacturer1 Example: VISHAY; Manufacturer1 ComponentHeight: 0.55mm; HelpURL: \\cern.ch\dfs\Applications\Altium\Datasheets\R0603_VISHAY_CRCW e3.pdf; Author: CERN DEM JLC; CreateDate: 12.01.2017; LatestRevisionDate: 12.01.2017
R62 = R0603_100K_0.1%_0.063W_10PPM: Resistor - 0.1%; Part Description: Thin Film Chip Resistor; Manufacturer: GENERIC; Manufacturer1 Part Number: RN73C1J100KBTDF; Power: 0.063W; TC: ±10ppm; PressFit: No; Part Number: R0603_100K_0.1%_0.063W_10PPM; Component Kind: Standard; Component Type: Standard; Pin Count: 2; Value: 100k; Status: Not Recommended; Manufacturer Part Number: R0603_100K_0.1%_0.063W_10PPM; Case: 0603; Mounted: Yes; Sense: No; Socket: No; SMD: Yes; Manufacturer1 Example: TYCO HOLSWORTHY; Manufacturer1 ComponentHeight: 0.55mm; HelpURL: \\cern.ch\dfs\Applications\Altium\Datasheets\R0603_Tyco_RN73.pdf; Author: CERN DEM JLC; CreateDate: 03.12.2007; LatestRevisionDate: 13.03.2008
R63 R85 = R0603_10K_0.1%_0.063W_10PPM: Resistor - 0.1%; Part Description: Thin Film Chip Resistor; Manufacturer: GENERIC; Manufacturer1 Part Number: RN73C1J10KBTDF; Power: 0.063W; TC: ±10ppm; PressFit: No; Part Number: R0603_10K_0.1%_0.063W_10PPM; Component Kind: Standard; Component Type: Standard; Pin Count: 2; Value: 10k; Status: Not Recommended; Manufacturer Part Number: R0603_10K_0.1%_0.063W_10PPM; Case: 0603; Mounted: Yes; Sense: No; Socket: No; SMD: Yes; Manufacturer1 Example: TYCO HOLSWORTHY; Manufacturer1 ComponentHeight: 0.5mm; HelpURL: \\cern.ch\dfs\Applications\Altium\Datasheets\R0603_Tyco_RN73.pdf; Author: CERN DEM JLC; CreateDate: 03.12.2007; LatestRevisionDate: 13.03.2008
R64 = R0603_33K2_0.1%_0.063W_10PPM: Resistor - 0.1%; Part Description: Thin Film Chip Resistor; Manufacturer: GENERIC; Manufacturer1 Part Number: RN73C1J33K2BTDF; Power: 0.063W; TC: ±10ppm; PressFit: No; Part Number: R0603_33K2_0.1%_0.063W_10PPM; Component Kind: Standard; Component Type: Standard; Pin Count: 2; Value: 33k2; Status: Not Recommended; Tolerance: ±0.1%; Manufacturer Part Number: R0603_33K2_0.1%_0.063W_10PPM; Case: 0603; Mounted: Yes; Sense: No; Socket: No; SMD: Yes; Manufacturer1 Example: TYCO HOLSWORTHY; Manufacturer1 ComponentHeight: 0.5mm; HelpURL: \\cern.ch\dfs\Applications\Altium\Datasheets\R0603_Tyco_RN73.pdf; Author: CERN DEM JLC; CreateDate: 03/12/2007; LatestRevisionDate: 13/03/2008
R74 R97 R99 R100 = R0402_0R_JUMPER: Resistor; Part Description: 1A (0.05R Max DC Resistance) Zero Ohm Jumper; Manufacturer: GENERIC; Manufacturer1 Part Number: 232270591001L; PressFit: No; Part Number: R0402_0R_JUMPER; Component Kind: Standard; Component Type: Standard; Pin Count: 2; Value: 0; Status: Not Recommended; Manufacturer Part Number: R0402_0R_JUMPER; Case: 0402; Mounted: Yes; Sense: No; Socket: No; SMD: Yes; Manufacturer1 Example: YAGEO PHYCOMP; Manufacturer1 ComponentHeight: 0.4mm; HelpURL: \\cern.ch\dfs\Applications\Altium\Datasheets\R0402_Phycomp_RC0402.pdf; Author: CERN DEM JLC; CreateDate: 03.12.2007; LatestRevisionDate: 17.10.2012
R98 = R0603_20K_0.1%_0.063W_10PPM: Resistor - 0.1%; Part Description: Thin Film Chip Resistor; Manufacturer: GENERIC; Manufacturer1 Part Number: RN73C1J20KBTDF; Power: 0.063W; TC: ±10ppm; PressFit: No; Part Number: R0603_20K_0.1%_0.063W_10PPM; Component Kind: Standard; Component Type: Standard; Pin Count: 2; Value: 20k; Status: Not Recommended; Manufacturer Part Number: R0603_20K_0.1%_0.063W_10PPM; Case: 0603; Mounted: Yes; Sense: No; Socket: No; SMD: Yes; Manufacturer1 Example: TYCO HOLSWORTHY; Manufacturer1 ComponentHeight: 0.5mm; HelpURL: \\cern.ch\dfs\Applications\Altium\Datasheets\R0603_Tyco_RN73.pdf; Author: CERN DEM JLC; CreateDate: 03.12.2007; LatestRevisionDate: 13.03.2008
R101 = R0402_2K4_1%_0.0625W_100PPM: Resistor - 1%; Part Description: General Purpose Thick Film Chip Resistor; Manufacturer: GENERIC; Manufacturer1 Part Number: 232270672402L; TC: ±100ppm/°C; PressFit: No; Part Number: R0402_2K4_1%_0.0625W_100PPM; Component Kind: Standard; Component Type: Standard; Pin Count: 2; Value: 2k4; Status: Not Recommended; Power: 0.0625W; Tolerance: ±1%; Manufacturer Part Number: R0402_2K4_1%_0.0625W_100PPM; Case: 0402; Mounted: Yes; Sense: No; Socket: No; SMD: Yes; Manufacturer1 Example: YAGEO PHYCOMP; Manufacturer1 ComponentHeight: 0.4mm; HelpURL: \\cern.ch\dfs\Applications\Altium\Datasheets\R0402_Phycomp_RC0402.pdf; Author: CERN DEM JLC; CreateDate: 03.12.2007; LatestRevisionDate: 17.10.2012
R102 = R0402_5K1_1%_0.0625W_100PPM: Resistor - 1%; Part Description: General Purpose Thick Film Chip Resistor; Manufacturer: GENERIC; Manufacturer1 Part Number: 232270675102L; TC: ±100ppm/°C; PressFit: No; Part Number: R0402_5K1_1%_0.0625W_100PPM; Component Kind: Standard; Component Type: Standard; Pin Count: 2; Value: 5k1; Status: Not Recommended; Power: 0.0625W; Tolerance: ±1%; Manufacturer Part Number: R0402_5K1_1%_0.0625W_100PPM; Case: 0402; Mounted: Yes; Sense: No; Socket: No; SMD: Yes; Manufacturer1 Example: YAGEO PHYCOMP; Manufacturer1 ComponentHeight: 0.4mm; HelpURL: \\cern.ch\dfs\Applications\Altium\Datasheets\R0402_Phycomp_RC0402.pdf; Author: CERN DEM JLC; CreateDate: 03.12.2007; LatestRevisionDate: 17.10.2012
RT1 = THERM_NTC_10K_EPCOS_B57330V2103J260: Thermistor NTC (Negative Temperature Coefficient); Part Description: SMD NTC Thermistor for Temperature Measurement; Manufacturer: EPCOS / TDK; Power: 180mW; Tolerance: ±5%; Part Number: THERM_NTC_10K_EPCOS_B57330V2103J260; Component Kind: Standard; Component Type: Standard; Pin Count: 2; Value: 10k; Status: None; Manufacturer Part Number: B57330V2103J260; Case: 0603; Mounted: Yes; Socket: No; SMD: Yes; Sense: No; ComponentHeight: 0.9mm; HelpURL: \\cern.ch\dfs\Applications\Altium\Datasheets\THERM_EPCOS_B573xxV2.pdf; Author: CERN DEM BC; CreateDate: 30.07.2015; LatestRevisionDate: 30.07.2015
T1-T9 = PMV40UN2: N-CHANNEL MOSFET WITH DIODE; Part Description: 30V 4.4A N-Channel Trench MOSFET; Manufacturer: NEXPERIA; PressFit: No; Bonding: No; Part Number: PMV40UN2; Component Kind: Standard; Component Type: Standard; Device: PMV40UN2; PackageDescription: SOT23, 0.95mm Pitch; 3 Pin, 1.30mm W X 2.90mm L X 1.10mm H body, IPC Medium Density; Manufacturer Part Number: PMV40UN2; Pin Count: 3; Case: SOT23-3; Mounted: Yes; Socket: No; SMD: Yes; Sense: No; ComponentHeight: 1.1mm; HelpURL: \\cern.ch\dfs\Applications\Altium\Datasheets\PMV40UN2.pdf; Author: CERN DEM BC; CreateDate: 23.04.2020; LatestRevisionDate: 23.04.2020
TP1-TP4 = SMD_PAD_1.27X1.27MM: Part Description: 1.27mm x 1.27mm PCB Copper Area (SMD Test Point); Mounted: No; Part Number: SMD_PAD_1.27X1.27MM; Component Kind: Standard (No BOM); Component Type: Standard (No BOM); Pin Count: 1; Family: Test Point; Socket: No; SMD: Yes; Sense: No; Status: None; ComponentHeight: 0mm; HelpURL: Undefined; Author: CERN DEM JLC; CreateDate: 12/01/2008; LatestRevisionDate: 12/01/2008; PackageDescription: 1.27mm x 1.27mm PCB Copper Area (SMD Test Point)